# Altium schematic sheet voeding.SchDoc: Soldeer station
size A4; DrawnBy: Jelle Claes; SheetNumber: 1; SheetTotal: 4; Number: PXL_EAI1_001
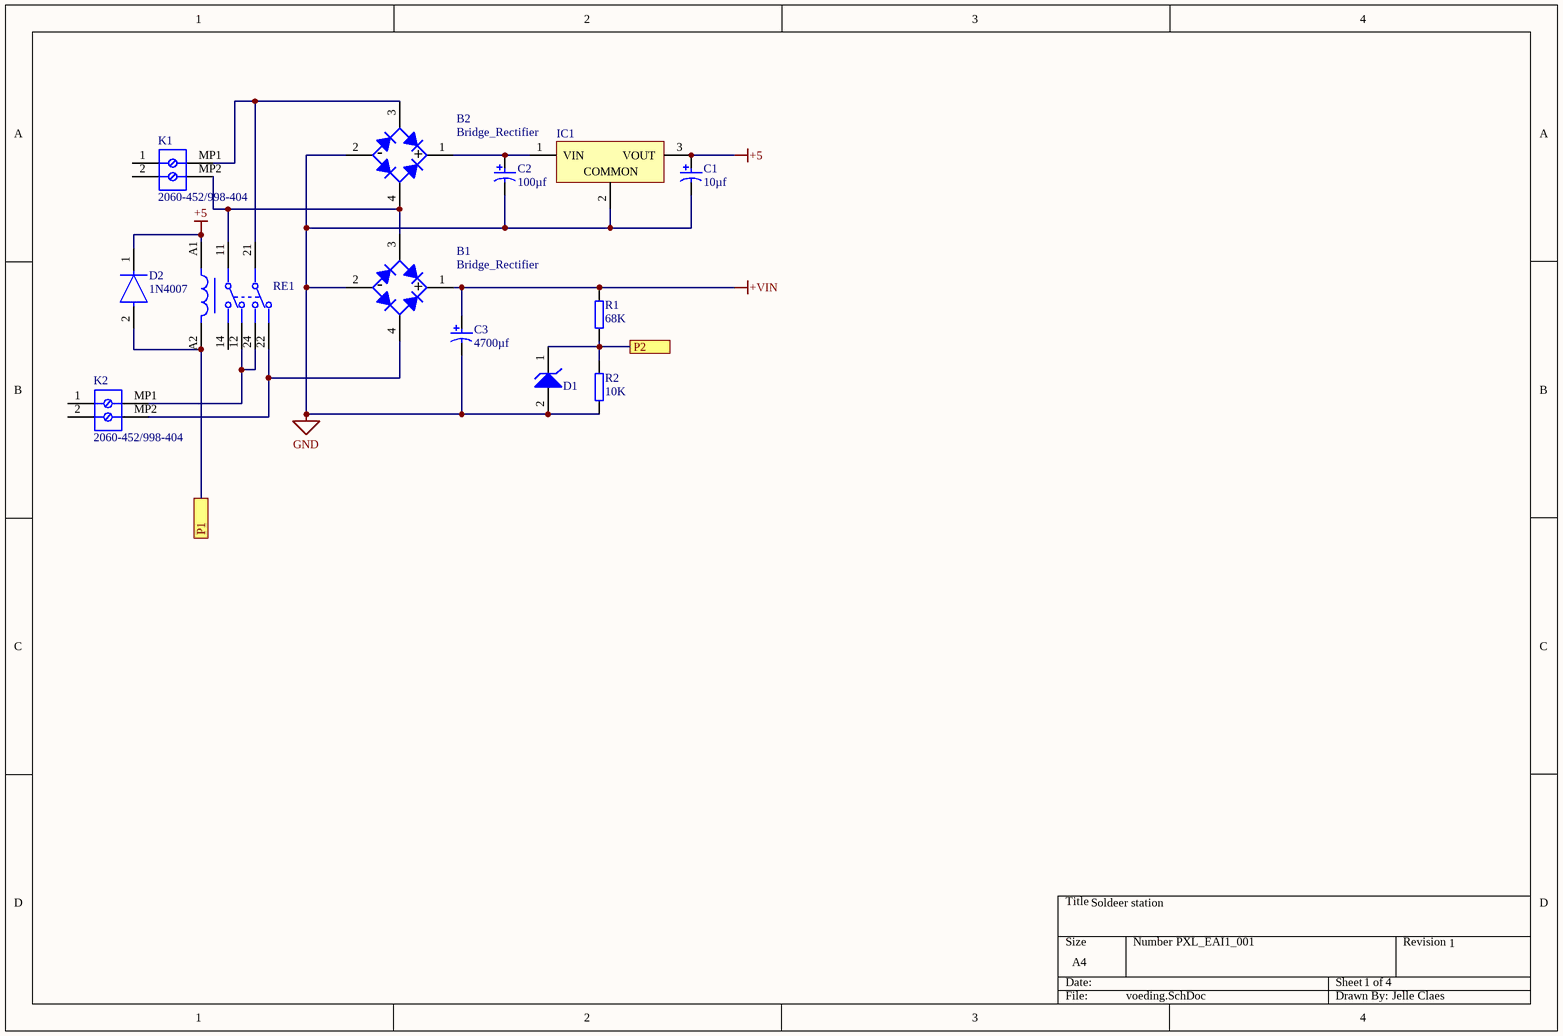
[diagram p0: voeding.SchDoc]

## Parts
B1  Bridge_Rectifier  [ttf]
B2  Bridge_Rectifier  [ttf]
C1  10µf  [D4L5.4]
C2  100µf  [CE_D8_L10]
C3  4700µf  [CE_D25_L25_plugin]
D1  Zener_Diode  [SOD-123FL]  (value not drawn)
D2  1N4007  [SOD-123FL]
IC1  OKI-78SR-5/1.5-W36-C  [OKI78SR515W36C]  (value not drawn)
K1  2060-452/998-404  [WAGO-2060-452_V]
K2  2060-452/998-404  [WAGO-2060-452_V]
R1  68K  [R_0805_M]
R2  10K  [R_0805_M]
RE1  RELAY_GENERAL_PURPOSE  [RT42]  (value not drawn)

## Ports
P1 (see CPU[1A]), P2 (see CPU[3B])

## Nets
+5: C1.2 D2.1(C) IC1.3(VOUT) RE1.A1
+VIN: B1.1(K) C3.2 R1.2
GND: B1.2(A) B2.2(A) C1.1 C2.1 C3.1 D1.2(A) IC1.2(COMMON) R2.1
P1: D2.2(A) RE1.A2 ; port P1
P2: D1.1(K) R1.1 R2.2 ; port P2
NetB1_3: B1.3(C) B2.4(C) K1.MP2 RE1.11
NetB1_4: B1.4(C) K2.MP2 RE1.22
NetB2_1: B2.1(K) C2.2 IC1.1(VIN)
NetB2_3: B2.3(C) K1.MP1 RE1.21
NetK2_MP1: K2.MP1 RE1.12 RE1.24

Not connected (* = marked no-connect by the designer): K1 1 2; K2 1 2; RE1 14

## Notes on the sheet
- 1
- (in symbol Bridge_Rectifier) -; +

## Library data of the parts
B1 B2 = Bridge_Rectifier: Manufacturer: Diodes Inc; Average Rectified Current-Max: 0.8A; Reverse Voltage-Max [Vrrm]: 600V; Forward Voltage: 1V; Peak Current-Max: 30A; Reverse Current-Max: 5µA; Package Version: 05/2016; Package URL: http://www.diodes.com/_files/packages/MiniDIP.pdf; Datasheet Version: Rev. 13-2, 12/2010; Datasheet URL: http://www.diodes.com/_files/datasheets/ds17003.pdf; Mounting Technology: SurfaceMount; Manufacturer URL: http://www.diodes.com/; Package Reference: MiniDIP-4; Package Description: 4-Pin Small Outline Integrated Circuit, Body 4.7 x 3.8 mm, Pitch 2.5 mm
C1-C3 = Capacitor_Electrolytic: Manufacturer: Panasonic; Voltage Rating: 25 V; ComponentLink2URL: http://industrial.panasonic.com/cdbs/www-data/pdf/RDE0000/ABA0000C1181.pdf; Height: 10.2 mm; Max Operating Temperature: 105 degC; PackageReference: EEE-FK1E221P; ComponentLink1Description: Manufacturer URL; ComponentLink1URL: http://www.panasonic.com/; Mount: Surface Mount; REACH SVHC: No SVHC; Min Operating Temperature: -55 degC; ComponentLink2Description: Datasheet; DatasheetVersion: 03/2016; Length: 10.2 mm; RoHSCompliant: true; Packaging: Tape and Reel; Package Quantity: 500; Lead Pitch: 3.1 mm; Pins: 2; PackageDescription: 2-Pin Electrolytic Aluminum Capacitor, Body 8.3 x 8.3 mm; Mounting Technology: Surface Mount
D1 = Zener_Diode: Manufacturer: On Semiconductor; PartNumber: 1SMB5920BT3G; Packing: Tape and Reel; VZ Typ (V): 6.2; PackageDescription: 2-Pin Small Molded Package, J-Bend Lead, Body 4.33 x 3.625 mm; Mounting Technology: Surface Mount; PackageVersion: Rev. H, 05/2011; ComponentLink1Description: Manufacturer URL; RoHS: Pb-Free; DatasheetVersion: Rev. 8; ComponentLink2Description: Datasheet; ComponentLink2URL: http://www.onsemi.com/pub_link/Collateral/1SMB5913BT3-D.PDF; ComponentLink1URL: http://www.onsemi.com/; ComponentLink3Description: Package Specification; PackageReference: SMB-2-403A-03_H; ComponentLink3URL: http://www.onsemi.com/pub_link/Collateral/1SMB5913BT3-D.PDF
D2 = Diode: Manufacturer: Diotec; Max Surge Forward Current: 27A; Forward Current: 1A; Max Junction Temp: +175°C; Reverse Voltage: 1000V; Value: 15pF; Peak Reverse Current: 5uA; Category: Diode; Temperature Range Low: -50°C; Automotive: No; Temperature: -50°C to +175°C; Lead Free: Yes; ComponentLink2Description: Datasheet; Max Repetitive Reverse Voltage: 1000V; ComponentLink2URL: https://datasheet.octopart.com/1N4007-Diotec-datasheet-62346875.pdf; Manufacturer Part Number: 1N4007; Device Class L3: Rectifier Diodes; Height: 2.8mm; Octopart: https://octopart.com/1n4007-diotec-4040411; Package: 1N4007; Temperature Range High: +175°C; Device Class L1: Discrete Semiconductors; Device Class L2: Diodes; RoHS: TRUE; Capacitance: 15pF; Ipc Land Pattern Name: DIOAD888W100L520D280
IC1 = OKI-78SR-5/1.5-W36-C: Non-Isolated DC/DC Converter, 7.5 W, 7 to 36 V, 1.5 A, -40 to 85 degC, 3-Pin THD, RoHS; Manufacturer: Murata; Current - Output (Max): 1.5A; Power (Watts) - Max: 8W; Efficiency: 90.5%; Voltage - Input (Min): 7V; Voltage - Input (Max): 36V; Voltage - Output 1: 5V; Number of Outputs: 1; Package / Case: 3-SIPModule; Features: SCP; Type: LinearRegulatorReplacement; Size / Dimension: 0.41"Lx0.30"Wx0.65"H(10.4mmx7.6mmx16.5mm); Datasheet URL: https://datasheet.ciiva.com/8006/1790439-8006672.pdf; Datasheet Version: Oct-13; Power (Watts) - Manufacture Series: 8W; Voltage - Output 2: -; Series: Okami™OKI-78SR; Family: DCDCConverters; Manufacturer URL: http://www.murata.com/; Category: PowerSupplies-BoardMount; Voltage - Isolation: -; Packaging: Tube; Applications: ITE(Commercial); Mounting Type: ThroughHole; Voltage - Output 3: -; Operating Temperature: -40degC~85degC
K1 K2 = WAGO-2060: Terminal Block, Pitch 4 mm, 1 x 2 Position, Height 4.5 mm, -60 to 105 degC, RoHS, Tape and Reel; Manufacturer: WAGO; Number of contacts: 2; Content: 1pc(s); Min. cross section (flexible): 0.25mm²; Stripping length: 6-7mm; Nominal current: 9A; Nominal voltage: 160V; Pitch: 4mm; Min. cross section (unflexible): 0.2mm²; Max. cross section (inflexible): 0.75mm²; AWG: 24-18; Connection: Pullspring; Type: 2060-452/998-404; Package Reference: 2060-452; Mounting Technology: SurfaceMount; Colour: White; Package Description: Terminal Block, Pitch 4 mm, 1 x 2 Position, Height 4.5 mm; Height: 4.5mm; Manufacturer URL: http://global.wago.com/en/index-en.jsp; Material: PPA-GFenclosure·Tin-platedcoppercontacts; Width: 10.1mm; Manufacturer part No.: 2060-452/998-404; Datasheet URL: http://www.wago.com/infomaterial/pdf/60255126.pdf; Contact material: Tinplated; Length: 7.9mm; Max. cross section (flexible): 0.75mm²; Datasheet Version: 03/2015
R1 R2 = Resistor: Manufacturer: Vishay Dale; Part Number: CRCW08050000Z0EA
RE1 = RELAY_GENERAL_PURPOSE: Manufacturer Part Number: RT424005; Manufacturer: TE Connectivity; Coil Power: 403mW; Throw Configuration: DPDT; Coil Voltage: 5V; Number Of Contacts: 2; Coil Resistance: 62Ω; Current Rating: 8A; Coil Type: Non-Latching; Category: Relay; Octopart: https://octopart.com/5-1393243-9-te+connectivity-41835766; Device Class L3: Power Relays; ComponentLink2URL: https://www.te.com/commerce/DocumentDelivery/DDEController?Action=showdoc&DocId=Data+Sheet%7FRT2%7F1014%7Fpdf%7FEnglish%7FENG_DS_RT2_1014.pdf%7F5-1393243-9; Ambient Temperature Range High: +85°C; ComponentLink2Description: Datasheet; Digikey Description: RELAY GENERAL PURPOSE DPDT 8A 5V; Package: RT424005; Automotive: No; Device Class L1: Electromechanical; Height: 15.7mm; Device Class L2: Relays; Ambient Temperature Range Low: -40°C; Mouser Description: General Purpose Relay, Rt2 Series, Power, Non Latching, Dpdt, 5 Vdc, 8 A Rohs Compliant: Yes; Lead Free: Yes; RoHS: TRUE